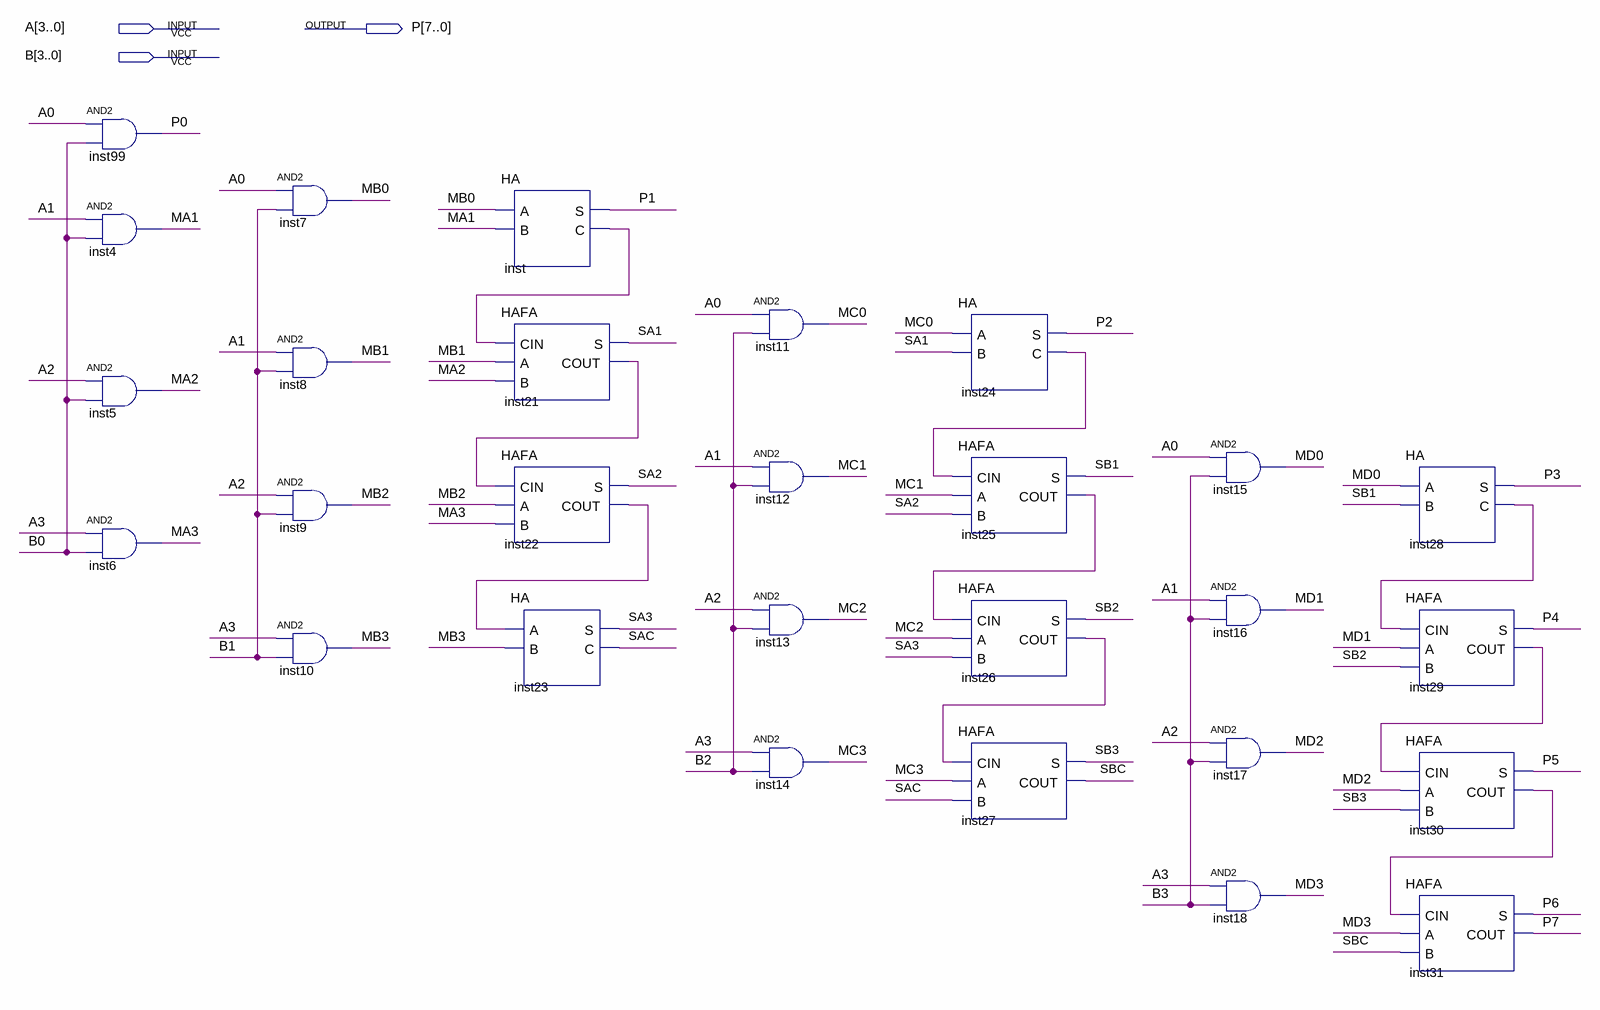
[diagram p0: schematic sheet]
// Quartus schematic MULT4.bdf as structural Verilog: 28 symbols, 3 pins
module MULT4 (
  input  [3:0] A,
  input  [3:0] B,
  output [7:0] P
);

  wire inst21_cout, inst22_cout, inst24_c, inst25_cout, inst26_cout, inst28_c, inst29_cout, inst30_cout,
       inst_c, MA1, MA2, MA3, MB0, MB1, MB2, MB3, MC0, MC1, MC2, MC3, MD0, MD1, MD2, MD3, SA1, SA2, SA3, SAC,
       SB1, SB2, SB3, SBC;

  and inst99 (P[0], A[0], B[0]);
  and inst4 (MA1, A[1], B[0]);
  and inst5 (MA2, A[2], B[0]);
  and inst6 (MA3, A[3], B[0]);
  and inst7 (MB0, A[0], B[1]);
  and inst8 (MB1, A[1], B[1]);
  and inst9 (MB2, A[2], B[1]);
  and inst10 (MB3, A[3], B[1]);
  HA inst (.A(MB0), .B(MA1), .S(P[1]), .C(inst_c));
  HAFA inst21 (.CIN(inst_c), .A(MB1), .B(MA2), .S(SA1), .COUT(inst21_cout));
  HAFA inst22 (.CIN(inst21_cout), .A(MB2), .B(MA3), .S(SA2), .COUT(inst22_cout));
  HA inst23 (.A(inst22_cout), .B(MB3), .S(SA3), .C(SAC));
  and inst11 (MC0, A[0], B[2]);
  and inst12 (MC1, A[1], B[2]);
  and inst13 (MC2, A[2], B[2]);
  and inst14 (MC3, A[3], B[2]);
  HA inst24 (.A(MC0), .B(SA1), .S(P[2]), .C(inst24_c));
  HAFA inst25 (.CIN(inst24_c), .A(MC1), .B(SA2), .S(SB1), .COUT(inst25_cout));
  HAFA inst26 (.CIN(inst25_cout), .A(MC2), .B(SA3), .S(SB2), .COUT(inst26_cout));
  HAFA inst27 (.CIN(inst26_cout), .A(MC3), .B(SAC), .S(SB3), .COUT(SBC));
  and inst15 (MD0, A[0], B[3]);
  and inst16 (MD1, A[1], B[3]);
  and inst17 (MD2, A[2], B[3]);
  and inst18 (MD3, A[3], B[3]);
  HA inst28 (.A(MD0), .B(SB1), .S(P[3]), .C(inst28_c));
  HAFA inst29 (.CIN(inst28_c), .A(MD1), .B(SB2), .S(P[4]), .COUT(inst29_cout));
  HAFA inst30 (.CIN(inst29_cout), .A(MD2), .B(SB3), .S(P[5]), .COUT(inst30_cout));
  HAFA inst31 (.CIN(inst30_cout), .A(MD3), .B(SBC), .S(P[6]), .COUT(P[7]));
endmodule
